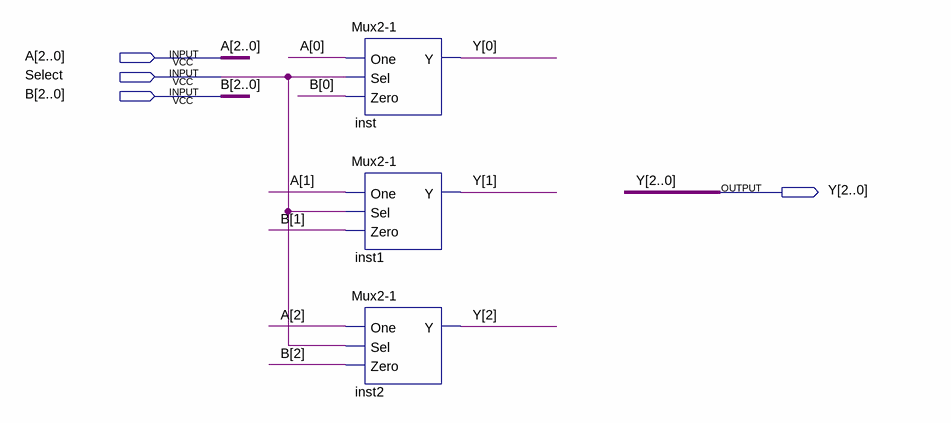
[diagram p0: schematic sheet]
// Quartus schematic Mux2-1-3bits.bdf as structural Verilog: 3 symbols, 4 pins
module \Mux2-1-3bits  (
  input  [2:0] A,
  input  Select,
  input  [2:0] B,
  output [2:0] Y
);

  \Mux2-1  inst (.One(A[0]), .Sel(Select), .Zero(B[0]), .Y(Y[0]));
  \Mux2-1  inst1 (.One(A[1]), .Sel(Select), .Zero(B[1]), .Y(Y[1]));
  \Mux2-1  inst2 (.One(A[2]), .Sel(Select), .Zero(B[2]), .Y(Y[2]));
endmodule
